# Altium schematic sheet Project2SCH.SchDoc
size A4; SheetNumber: 1; SheetTotal: 1
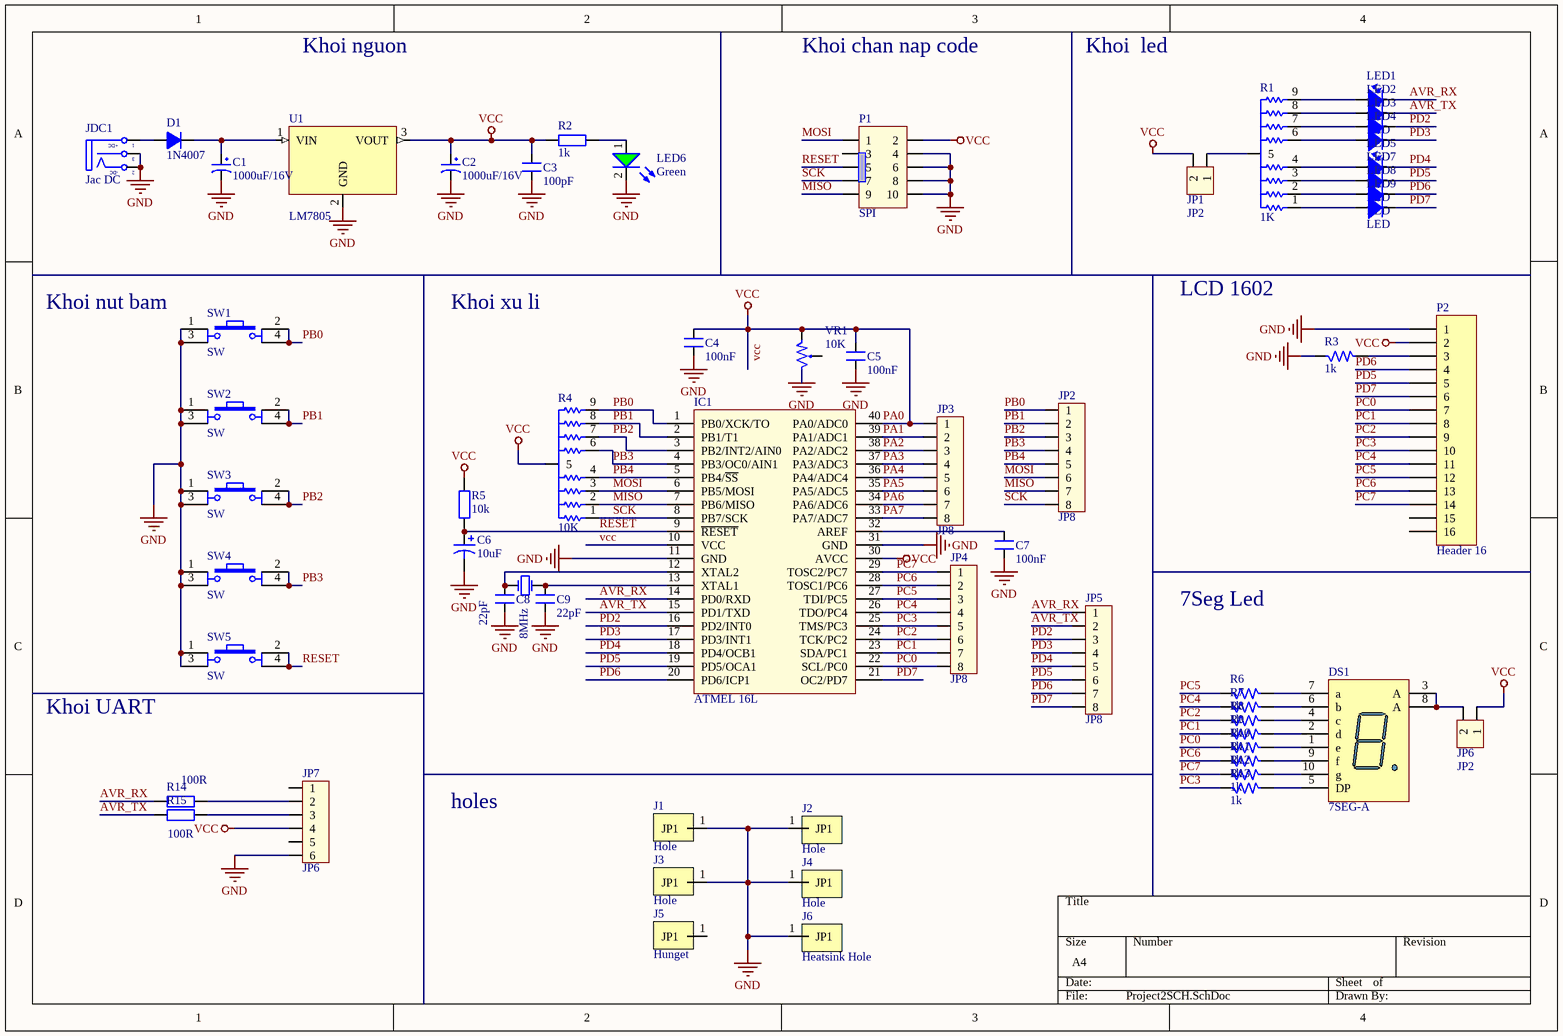
[diagram p0: Project2SCH.SchDoc]

## Parts
C1  1000uF/16V  [CP1.5/3.4]
C2  1000uF/16V  [CP1.5/3.4]
C3  100pF  [CN1]
C4  100nF  [CN1]
C5  100nF  [CN1]
C6  10uF  [C5mm]
C7  100nF  [CN1]
C8  22pF  [CN1]
C9  22pF  [CN1]
D1  1N4007  [D2A]
DS1  7SEG-A  [LED7SEG]
IC1  ATMEL 16L  [DIP40/W0.6]
J1  Hole  [JP1]
J2  Hole  [JP1]
J3  Hole  [JP1]
J4  Hole  [JP1]
J5  Hunget  [JP1]
J6  Heatsink Hole  [JP1]
JDC1  Jac DC  [DC-IN]
JP1  JP2  [CON2]
JP2  JP8  [CON8]
JP3  JP8  [CON8]
JP4  JP8  [CON8]
JP5  JP8  [CON8]
JP6  JP2  [CON2]
JP7  JP6  [CON6]
LED1  LED  [LED-V]
LED2  LED  [LED-V]
LED3  LED  [LED-V]
LED4  LED  [LED-V]
LED5  LED  [LED-V]
LED6  value Green  [LED5G]  (hidden comment: LED_G_5)
LED7  LED  [LED-V]
LED8  LED  [LED-V]
LED9  LED  [LED-V]
P1  SPI  [IDE_2X5]
P2  Header 16  [HDR1X16]
R1  1K  [RN8]
R2  1k  [R1/4W]
R3  1k  [R1/6W]
R4  10K  [RN8]
R5  10k  [R1/4W]
R6  1k  [R1/6W]
R7  1k  [R1/6W]
R8  1k  [R1/6W]
R9  1k  [R1/6W]
R10  1k  [R1/6W]
R11  1k  [R1/6W]
R12  1k  [R1/6W]
R13  1k  [R1/6W]
R14  100R  [R1/4W]
R15  100R  [R1/4W]
SW1  SW  [SW-4P-S]
SW2  SW  [SW-4P-S]
SW3  SW  [SW-4P-S]
SW4  SW  [SW-4P-S]
SW5  SW  [SW-4P-S]
U1  LM7805  [QTO-220H3]
VR1  10K  [VR]
Y1  8MHz  [XT2]

## Nets
GND: C1.2 C2.2 C3.1 C4.1 C5.1 C6.2 C7.1 C8.1 C9.1 IC1.11(GND) IC1.31(GND) J1.1(JP1) J2.1(JP1) J3.1(JP1) J4.1(JP1) J6.1(JP1) JDC1.2(TN) JDC1.3(S) JP7.6 LED6.2(K) P1.4 P1.6 P1.8 P1.10 P2.1 R3.1 SW1.1 SW1.3 SW2.1 SW2.3 SW3.1 SW3.3 SW4.1 SW4.3 SW5.1 SW5.3 U1.2(GND) VR1.3
PA0: C2.1 C3.2 C4.2 C5.2 IC1.10(VCC) IC1.30(AVCC) IC1.40(PA0/ADC0) JP1.2 JP3.1 JP6.1 JP7.4 P1.2 P2.2 R2.1 R4.5 R5.2 U1.3(VOUT) VR1.1  [also labelled VCC]
AVR_RX: IC1.14(PD0/RXD) JP5.1 LED1.2 R14.1
AVR_TX: IC1.15(PD1/TXD) JP5.2 LED2.2 R15.1
MISO: IC1.7(PB6/MISO) JP2.7 P1.9 R4.2
MOSI: IC1.6(PB5/MOSI) JP2.6 P1.1 R4.3
PA1: IC1.39(PA1/ADC1) JP3.2
PA2: IC1.38(PA2/ADC2) JP3.3
PA3: IC1.37(PA3/ADC3) JP3.4
PA4: IC1.36(PA4/ADC4) JP3.5
PA5: IC1.35(PA5/ADC5) JP3.6
PA6: IC1.34(PA6/ADC6) JP3.7
PA7: IC1.33(PA7/ADC7) JP3.8
PB0: IC1.1(PB0/XCK/TO) JP2.1 R4.9 SW1.2 SW1.4
PB1: IC1.2(PB1/T1) JP2.2 R4.8 SW2.2 SW2.4
PB2: IC1.3(PB2/INT2/AIN0) JP2.3 R4.7 SW3.2 SW3.4
PB3: IC1.4(PB3/OC0/AIN1) JP2.4 R4.6 SW4.2 SW4.4
PB4: IC1.5(PB4/~{SS}) JP2.5 R4.4
PC0: IC1.22(SCL/PC0) JP4.8 P2.7 R10.1
PC1: IC1.23(SDA/PC1) JP4.7 P2.8 R9.1
PC2: IC1.24(TCK/PC2) JP4.6 P2.9 R8.1
PC3: IC1.25(TMS/PC3) JP4.5 P2.10 R13.1
PC4: IC1.26(TDO/PC4) JP4.4 P2.11 R7.1
PC5: IC1.27(TDI/PC5) JP4.3 P2.12 R6.1
PC6: IC1.28(TOSC1/PC6) JP4.2 P2.13 R11.1
PC7: IC1.29(TOSC2/PC7) JP4.1 P2.14 R12.1
PD2: IC1.16(PD2/INT0) JP5.3 LED3.2
PD3: IC1.17(PD3/INT1) JP5.4 LED4.2
PD4: IC1.18(PD4/OCB1) JP5.5 LED5.2
PD5: IC1.19(PD5/OCA1) JP5.6 LED7.2 P2.5
PD6: IC1.20(PD6/ICP1) JP5.7 LED8.2 P2.4
PD7: IC1.21(OC2/PD7) JP5.8 LED9.2 P2.6
RESET: C6.1 IC1.9(~{RESET}) P1.5 R5.1 SW5.2 SW5.4
SCK: IC1.8(PB7/SCK) JP2.8 P1.7 R4.1
NetC1_1: C1.1 D1.2(K) U1.1(VIN)
NetC7_2: C7.2 IC1.32(AREF)
NetC8_2: C8.2 IC1.12(XTAL2) Y1.1(OSC1)
NetC9_2: C9.2 IC1.13(XTAL1) Y1.2(OSC2)
NetD1_1: D1.1(A) JDC1.1(T)
NetDS1_1: DS1.1(e) R10.2
NetDS1_2: DS1.2(d) R9.2
NetDS1_3: DS1.3(A) DS1.8(A) JP6.2
NetDS1_4: DS1.4(c) R8.2
NetDS1_5: DS1.5(DP) R13.2
NetDS1_6: DS1.6(b) R7.2
NetDS1_7: DS1.7(a) R6.2
NetDS1_9: DS1.9(f) R11.2
NetDS1_10: DS1.10(g) R12.2
NetJP1_1: JP1.1 R1.5
NetJP7_2: JP7.2 R14.2
NetJP7_3: JP7.3 R15.2
NetLED1_1: LED1.1 R1.9
NetLED2_1: LED2.1 R1.8
NetLED3_1: LED3.1 R1.7
NetLED4_1: LED4.1 R1.6
NetLED5_1: LED5.1 R1.4
NetLED6_1: LED6.1(A) R2.2
NetLED7_1: LED7.1 R1.3
NetLED8_1: LED8.1 R1.2
NetLED9_1: LED9.1 R1.1
NetP2_3: P2.3 R3.2

Not connected (* = marked no-connect by the designer): J5 1(JP1); JP7 1 5; P1 3; P2 15 16; VR1 2

## Notes on the sheet
- Khoi nguon
- Khoi chan nap code
- Khoi  led
- (near SW1) Khoi nut bam
- Khoi xu li
- LCD 1602
- 7Seg Led
- Khoi UART
- holes
- (in symbol DCIN) +DC; -DC

## Library data of the parts
C1 C2 = CP4: Cap 1000uF/16V - 220uF/50V; Description 5: 4,7uF>10uF/250V_3,3uF>10uF/400V - 2,2uF>4,7uF/450V; Description 1: 2200uF-3300uF/6,3V - 1000uF-2200uF/10V; Description 2: 1000uF/16V - 470uF => 1000uF/25V - 100uF/100V; Description 3: 330uF>470uF/35V_220uF>470uF/50V_10uF>22uF/250V; Description 4: 220uF => 330uF/63V - 10uF =>33uF/160 - 200V; Value: 1000uF/16V
C3 = CN1: Cap np  1pF - 472pF; Value: 100pF
C4 C5 C7-C9 = CN1: Cap np  1pF - 472pF; Value: 100pF
C6 = Cap Pol 5mm: Polarized Capacitor (Axial); Published: 8-Jun-2000; LatestRevisionDate: 17-Jul-2002; LatestRevisionNote: Re-released for DXP Platform.; PackageReference: POLAR0.8; Publisher: Altium Limited
D1 = D1A: Diode 1A; Value: 1N4007
DS1 = LED7SEG-A: 14.2 mm General Purpose Blue 7-Segment Display: CA, RH DP, Gray Surface; MinimumIntensity: 2020 ucd; Note: IF = 10 mA; Published: 8-Jun-2000; LatestRevisionDate: 17-Dec-2003; LatestRevisionNote: Schematic revised, PCB Footprint replaced.; DatasheetDocument: 24-Sep-2002; PackageDocument: 24-Sep-2002; PackageReference: H; Publisher: Altium Limited; Colour: Blue; ComponentLink1Description: Manufacturer Link; ComponentLink1URL: http://www.agilent.com/
IC1 = Atmega16L: 8-Bit AVR Microcontroller with 16K Bytes of In-System Programmable Flash Memory; Value: Atmega 16L
J1-J6 = JP1
JDC1 = DCIN: Jac DC input; Value: Jac DC
JP1 JP6 = Con2: Connector 2; Value: Connector 2
JP2-JP5 = Con8: Connector 8; Value: Connector 8
JP7 = Con6: Connector 6; Value: Connector 6
LED1-LED5 LED7-LED9 = LED: LED Single colour Green and Red; Value: LED 3 ly Single Colour
LED6 = LED_GREEN_5MM: LED Green 5mm; ComponentLink1Description: Datasheet; ComponentLink1URL: D:\Dropbox\Datasheets\Opto and Illumination\LEDs\SMD LED.pdf; Unit Price: 0.0476
P1 = IDE 5x2: Header 5x2; Value: Header 5x2
P2 = Header 16: Header, 16-Pin; LatestRevisionDate: 17-Jul-2002; LatestRevisionNote: Re-released for DXP Platform.; Publisher: Altium Limited
R1 = RKC8LD: Resistor Pack 4x2; Value: 10K
R2 R5 R14 R15 = R1/4W: Resistor 1/4W; Value: R1/4W - 1K
R3 R6-R13 = Res: Resistor 1/4W; Value: R1/4W - 1K
R4 = RKC8LD: Resistor Pack 4x2; Value: 10K
SW1-SW5 = SW4: Switch button 4 pin; Value: Button chip 4 pin
U1 = LM7805: TO-220; Text Field1: 70; Text Field2: 30
VR1 = VR1: Var Resistor; Value: VR 10K
Y1 = Crystal: Crystal Oscillator; Published: 8-Jun-2000; LatestRevisionDate: 17-Jul-2002; LatestRevisionNote: Re-released for DXP Platform.; PackageReference: R38; Publisher: Altium Limited